# Altium schematic sheet Atmega328p.SchDoc
size A
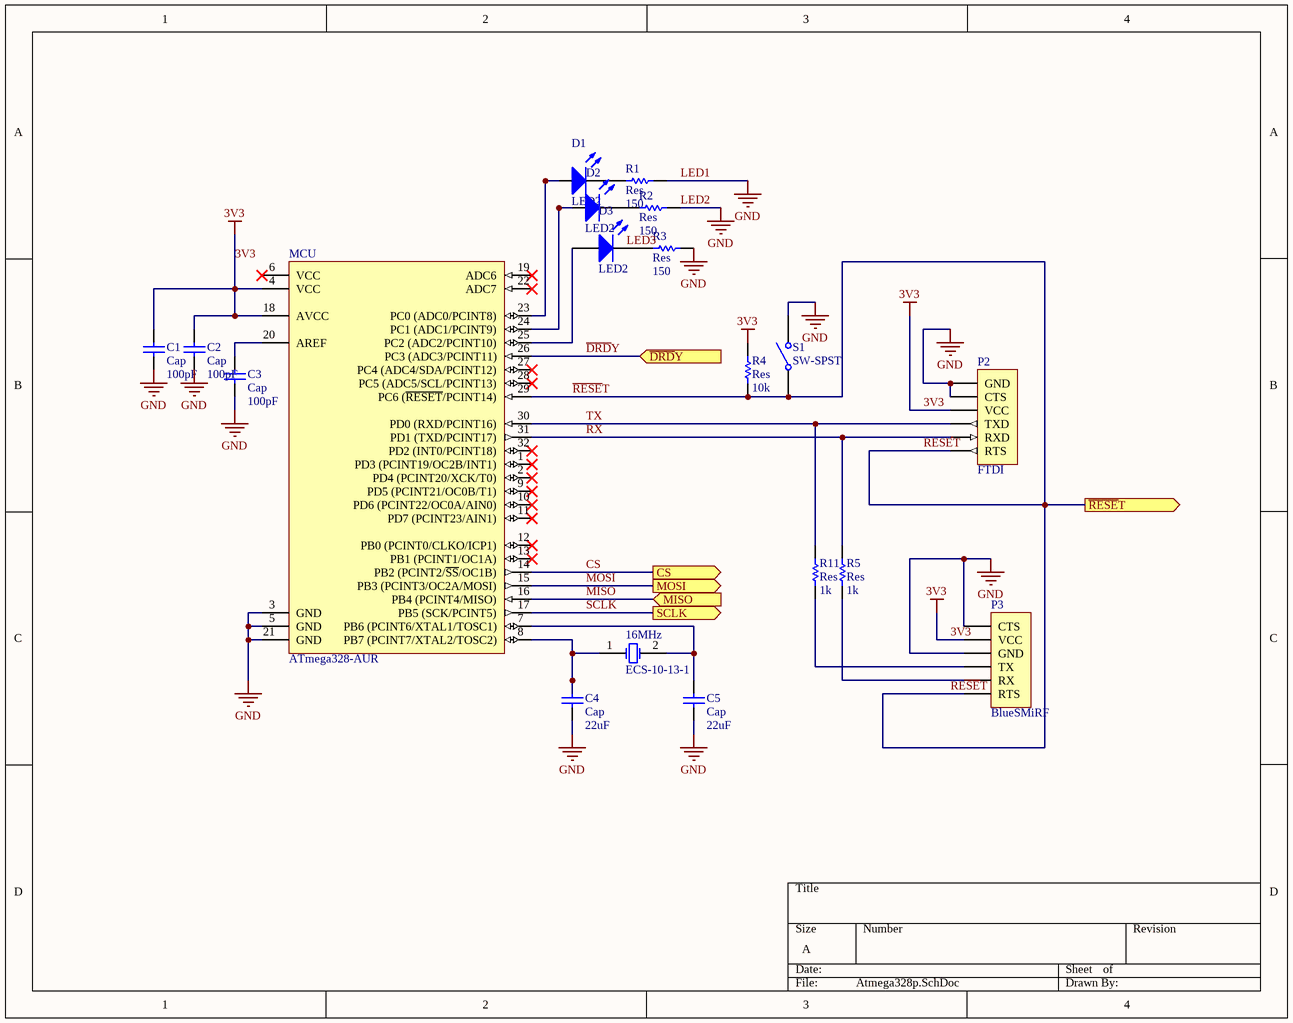
[diagram p0: Atmega328p.SchDoc]

## Parts
16MHz  ECS-10-13-1  [HC-49U]
C1  Cap  C1: 100pF  [1608[0603]]
C2  Cap  C1: 100pF  [1608[0603]]
C3  Cap  C1: 100pF  [1608[0603]]
C4  Cap  value 22uF  [1608[0603]]
C5  Cap  value 22uF  [1608[0603]]
D1  LED2  [3.2X1.6X1.1]
D2  LED2  [3.2X1.6X1.1]
D3  LED2  [3.2X1.6X1.1]
MCU  ATmega328-AUR  [32A_N]
P2  FTDI  [HDR1X6]
P3  BlueSMiRF  [HDR1X6]
R1  Res  value 150  [1608[0603]]
R2  Res  value 150  [1608[0603]]
R3  Res  value 150  [1608[0603]]
R4  Res  value 10k  [J1-0603]
R5  Res  value 1k  [1608[0603]]
R11  Res  value 1k  [1608[0603]]
S1  SW-SPST  [SPST-2]

## Ports
CS (out), MISO (in), MOSI (out), SCLK (out), ~{DRD}Y (in), ~{RESE}T (out)

## Nets
3V3: C1.2 C2.2 MCU.4(VCC) MCU.18(AVCC) P2.3(VCC) P3.2(VCC) R4.2
LED1: C1.1 C2.1 C3.1 C4.1 C5.1 MCU.3(GND) MCU.5(GND) MCU.21(GND) P2.1(GND) P2.2(CTS) P3.1(CTS) P3.3(GND) R1.1 R2.1 R3.1 S1.2(NO)  [also labelled GND, LED2]
CS: MCU.14(PB2_(PCINT2/~{SS}/OC1B)) ; port CS
~{DRD}Y: MCU.26(PC3_(ADC3/PCINT11)) ; port ~{DRD}Y
MISO: MCU.16(PB4_(PCINT4/MISO)) ; port MISO
MOSI: MCU.15(PB3_(PCINT3/OC2A/MOSI)) ; port MOSI
~{RESE}T: MCU.29(PC6_(~{RESET}/PCINT14)) P2.6(RTS) P3.6(RTS) R4.1 S1.1(COMMON) ; port ~{RESE}T
RX: MCU.31(PD1_(TXD/PCINT17)) P2.5(RXD) R5.1
SCLK: MCU.17(PB5_(SCK/PCINT5)) ; port SCLK
TX: MCU.30(PD0_(RXD/PCINT16)) P2.4(TXD) R11.1
Net16MHz_1: 16MHz.1(OSC1) C4.2 MCU.8(PB7_(PCINT7/XTAL2/TOSC2))
Net16MHz_2: 16MHz.2(OSC2) C5.2 MCU.7(PB6_(PCINT6/XTAL1/TOSC1))
NetC3_2: C3.2 MCU.20(AREF)
NetD1_1: D1.1(A) MCU.23(PC0_(ADC0/PCINT8))
NetD1_2: D1.2(K) R1.2
NetD2_1: D2.1(A) MCU.24(PC1_(ADC1/PCINT9))
NetD2_2: D2.2(K) R2.2
NetD3_1: D3.1(A) MCU.25(PC2_(ADC2/PCINT10))
NetD3_2: D3.2(K) R3.2
NetP3_4: P3.4(TX) R11.2
NetP3_5: P3.5(RX) R5.2

Not connected (* = marked no-connect by the designer): MCU 1(PD3_(PCINT19/OC2B/INT1))* 2(PD4_(PCINT20/XCK/T0))* 6(VCC)* 9(PD5_(PCINT21/OC0B/T1))* 10(PD6_(PCINT22/OC0A/AIN0))* 11(PD7_(PCINT23/AIN1))* 12(PB0_(PCINT0/CLKO/ICP1))* 13(PB1_(PCINT1/OC1A))* 19(ADC6)* 22(ADC7)* 27(PC4_(ADC4/SDA/PCINT12))* 28(PC5_(ADC5/SCL/PCINT13))* 32(PD2_(INT0/PCINT18))*

## Notes on the sheet
- Labels drawn without touching a wire or pin: LED3

## Library data of the parts
16MHz = ECS-10-13-1: Crystal Oscillator; Published: 17-Jul-2002; DatasheetDocument: 18-Apr-2000; PackageReference: HC-49U; Publisher: Altium Limited; ComponentLink1Description: Manufacturer Link; ComponentLink1URL: http://www.ecsxtal.com/; ComponentLink2Description: Datasheet; ComponentLink2URL: http://www.ecsxtal.com/pdf2/HC49U.PDF
C1-C5 = Cap: Capacitor; Published: 8-Jun-2000; LatestRevisionDate: 17-Jul-2002; LatestRevisionNote: Re-released for DXP Platform.; PackageReference: RAD-0.3; Publisher: Altium Limited; PackageDescription: Radial Cap, Thru-Hole; 2 Leads; 0.3 in Pin Spacing
D1-D3 = LED2: Typical RED, GREEN, YELLOW, AMBER GaAs LED; Published: 8-Jun-2000; LatestRevisionDate: 17-Jul-2002; LatestRevisionNote: Re-released for DXP Platform.; PackageVersion: Feb-2002; PackageReference: 3.2X1.6X1.1; Publisher: Altium Limited; PackageDescription: SM LED; 2 Flat Leads
MCU = ATmega328-AUR: 8-bit AVR Microcontroller, 32KB Flash, 1KB EEPROM, 2KB SRAM, 32-pin TQFP, Industrial Grade (-40°C to 85°C); Published: 1-Apr-2010; DatasheetVersion: revA, Jan-2010; PackageVersion: revB, Oct-2001; PackageReference: 32A; Publisher: Altium Limited; PackageDescription: 32-Lead, 7x7x1.0 mm Body, 0.8mm Lead Pitch, Thin Profile Plastic Quad Flat Package (TQFP); Supplier 1: Digi-Key; Supplier Part Number 1: ATMEGA328-AUR-ND; Supplier 2: Mouser; Supplier Part Number 2: 556-ATMEGA328-AUR; Code_JEDEC: MS-026-ABA; ComponentLink1Description: Manufacturer Link; ComponentLink1URL: http://www.atmel.com/products/avr/default.asp?; ComponentLink2Description: ATmega48A/48PA/88A/88PA/168A/168PA/328/328P Datasheet; ComponentLink2URL: http://www.atmel.com/dyn/resources/prod_documents/8271.pdf; ComponentLink3Description: ATmega48A/48PA/88A/88PA/168A/168PA/328/328P Summary; ComponentLink3URL: http://www.atmel.com/dyn/resources/prod_documents/8271S.pdf; ComponentLink4Description: Atmel.com Home; ComponentLink4URL: http://www.atmel.com
P2 P3 = Header 6: Header, 6-Pin; LatestRevisionDate: 17-Jul-2002; LatestRevisionNote: Re-released for DXP Platform.; Publisher: Altium Limited
R1-R5 R11 = Res1: Resistor; Published: 8-Jun-2000; LatestRevisionDate: 17-Jul-2002; LatestRevisionNote: Re-released for DXP Platform.; PackageReference: AXIAL-0.3; Publisher: Altium Limited; PackageDescription: Axial Device, Thru-Hole; 2 Leads; 0.3 in Pin Spacing
S1 = SW-SPST: Single-Pole, Single-Throw Switch; Published: 24-Mar-1999; LatestRevisionDate: 17-Jul-2002; LatestRevisionNote: Re-released for DXP Platform.; PackageReference: SPST-2; Publisher: Altium Limited; PackageDescription: Switch; 2 Leads